# Altium schematic sheet Sheet1.SchDoc
size A3
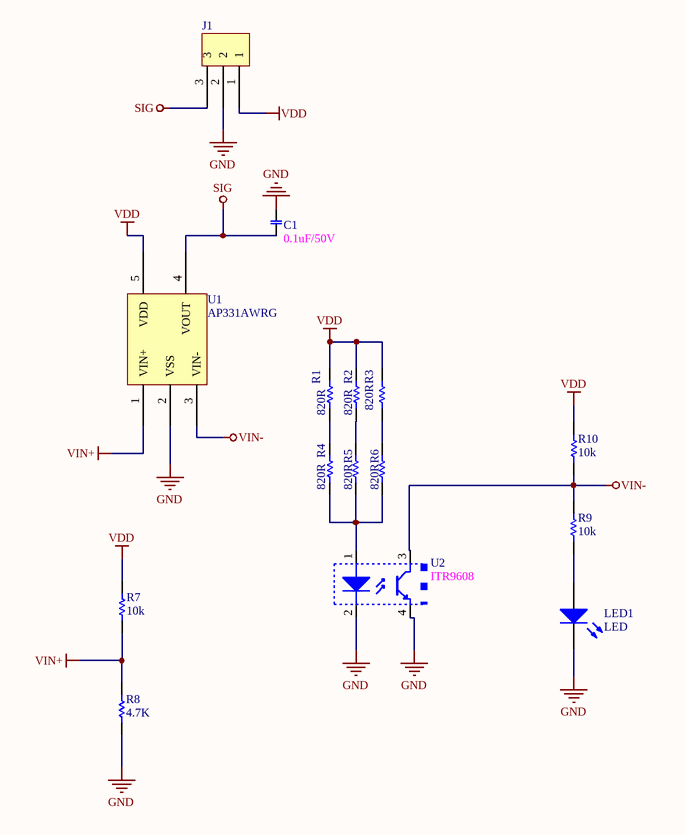
[diagram p0: Sheet1.SchDoc]

## Parts
C1  0.1uF/50V  [C0603T]
J1  3*1.27  [XH2.54-3AW]  (value not drawn)
LED1  LED  [LED0603]
R1  820R  [R0805]
R2  820R  [R0805]
R3  820R  [R0805]
R4  820R  [R0805]
R5  820R  [R0805]
R6  820R  [R0805]
R7  10k  [R0603]
R8  4.7K  [R0603]
R9  10k  [R0603]
R10  10k  [R0603]
U1  AP331AWRG  [SOT23-5]
U2  ITR9608  [ITR9608]

## Nets
GND: C1.2 J1.2 LED1.2(K) R8.2 U1.2(VSS) U2.2 U2.4
SIG: C1.1 J1.3 U1.4(VOUT)
VDD: J1.1 R1.2 R2.2 R3.2 R7.2 R10.2 U1.5(VDD)
VIN+: R7.1 R8.1 U1.1(VIN+)
VIN-: R9.2 R10.1 U1.3(VIN-) U2.3
NetLED1_1: LED1.1(A) R9.1
NetR1_1: R1.1 R4.2
NetR2_1: R2.1 R5.2
NetR3_1: R3.1 R6.2
NetR4_1: R4.1 R5.1 R6.1 U2.1

## Library data of the parts
C1 = CAP: CAP MC SMD 50V 22pF J C0G 0603; MPN: GRM1885C1H220JA01D; Company: MURATA
J1 = 3PIN_1.27
LED1 = LED_1
R1-R6 = Res1_2: Resistor; Value: 10K; Published: 8-Jun-2000; LatestRevisionDate: 17-Jul-2002; LatestRevisionNote: Re-released for DXP Platform.; PackageReference: AXIAL-0.3; Publisher: Altium Limited; PackageDescription: Axial Device, Thru-Hole; 2 Leads; 0.3 in Pin Spacing
R7 R9 R10 = Res1: Resistor; Published: 8-Jun-2000; LatestRevisionDate: 17-Jul-2002; LatestRevisionNote: Re-released for DXP Platform.; PackageReference: AXIAL-0.3; Publisher: Altium Limited; Value: 10K
R8 = Res1: Resistor; Value: 10K; Published: 8-Jun-2000; LatestRevisionDate: 17-Jul-2002; LatestRevisionNote: Re-released for DXP Platform.; PackageReference: AXIAL-0.3; Publisher: Altium Limited
U1 = OP
U2 = PHOTO-1: PHOTOCOUPLER PS2701A 70V 30mA L rank SMD; MPN: PS2701A L rank; Company: NEC